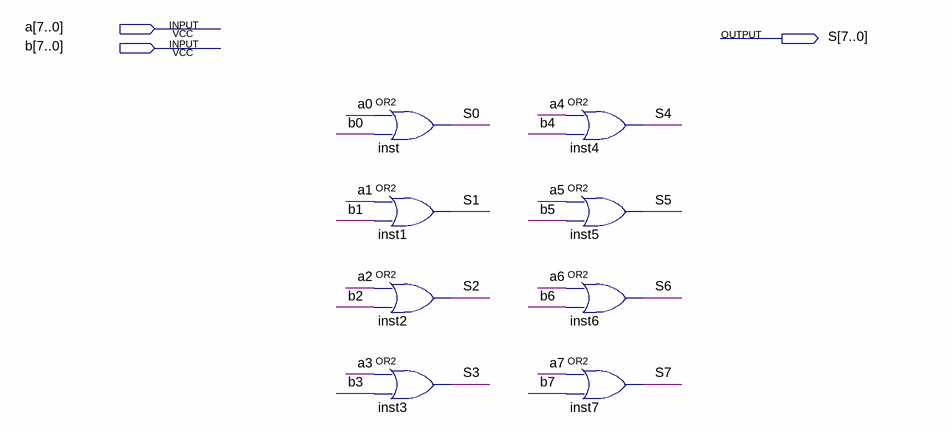
[diagram p0: schematic sheet]
// Quartus schematic or_8bits.bdf as structural Verilog: 8 symbols, 3 pins
module or_8bits (
  input  [7:0] a,
  input  [7:0] b,
  output [7:0] S
);

  or inst (S[0], a[0], b[0]);
  or inst1 (S[1], a[1], b[1]);
  or inst2 (S[2], a[2], b[2]);
  or inst3 (S[3], a[3], b[3]);
  or inst4 (S[4], a[4], b[4]);
  or inst5 (S[5], a[5], b[5]);
  or inst6 (S[6], a[6], b[6]);
  or inst7 (S[7], a[7], b[7]);
endmodule
